# Altium schematic sheet Off-Board Connections.SchDoc
size A
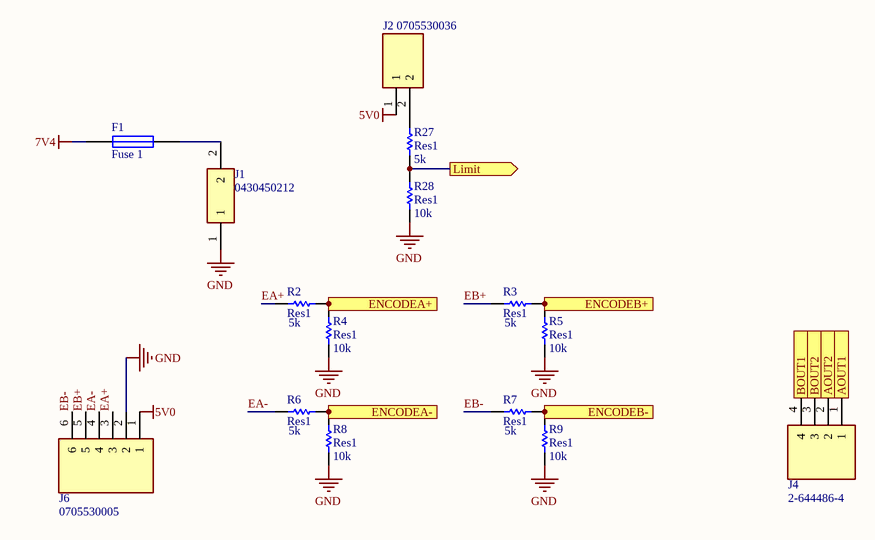
[diagram p0: Off-Board Connections.SchDoc]

## Parts
F1  Fuse 1  [C1206]
J1  0430450212  [0430450212]
J2  0705530036  [SHDRRA2W64P0X254_1X2_737X1359X699P]
J4  2-644486-4  [26444864]
J6  0705530005  [SHDRRA6W64P0X254_1X6_1779X1359X699P]
R2  Res1  value 5k  [0402-A]
R3  Res1  value 5k  [0402-A]
R4  Res1  value 10k  [0402-A]
R5  Res1  value 10k  [0402-A]
R6  Res1  value 5k  [0402-A]
R7  Res1  value 5k  [0402-A]
R8  Res1  value 10k  [0402-A]
R9  Res1  value 10k  [0402-A]
R27  Res1  value 5k  [0402-A]
R28  Res1  value 10k  [0402-A]

## Ports
AOUT1 (in), AOUT2 (in), BOUT1 (in), BOUT2 (in), ENCODEA+ (out), ENCODEA- (out), ENCODEB+ (out), ENCODEB- (out), Limit (out)

## Nets
5V0: J2.1 J6.1
7V4: F1.1
GND: J1.1 J6.2 R4.2 R5.2 R8.2 R9.2 R28.2
AOUT1: J4.1 ; port AOUT1
AOUT2: J4.2 ; port AOUT2
BOUT1: J4.4 ; port BOUT1
BOUT2: J4.3 ; port BOUT2
EA+: J6.3 R2.2
EA-: J6.4 R6.2
EB+: J6.5 R3.2
EB-: J6.6 R7.2
ENCODEA+: R2.1 R4.1 ; port ENCODEA+
ENCODEA-: R6.1 R8.1 ; port ENCODEA-
ENCODEB+: R3.1 R5.1 ; port ENCODEB+
ENCODEB-: R7.1 R9.1 ; port ENCODEB-
Limit: R27.2 R28.1 ; port Limit
NetF1_2: F1.2 J1.2
NetJ2_2: J2.2 R27.1

## Library data of the parts
F1 = Fuse 1: Fuse; Published: 8-Jun-2000; LatestRevisionDate: 17-Jul-2002; LatestRevisionNote: Re-released for DXP Platform.; PackageReference: PIN-W2/E2.8; Publisher: Altium Limited; PackageDescription: Thru-Hole; 2 Leads
J1 = 0430450212: Connector; Manufacturer_Name: Molex; Datasheet Link: http://www.molex.com/pdm_docs/sd/430450212_sd.pdf; Manufacturer_Part_Number: 0430450212; Arrow Part Number: 0430450212; Arrow Price/Stock: https://www.arrow.com/en/products/0430450212/molex
J2 = 0705530036: Connector; Manufacturer_Name: Molex; Datasheet Link: https://www.molex.com/pdm_docs/sd/705530036_sd.pdf; Height: 6.99mm; Manufacturer_Part_Number: 0705530036; Mouser Part Number: N/A; Mouser Price/Stock: https://www.mouser.com/Search/Refine.aspx?Keyword=N%2FA; Arrow Part Number: 0705530036; Arrow Price/Stock: https://www.arrow.com/en/products/0705530036/molex
J4 = 2-644486-4: Connector; Manufacturer_Name: TE Connectivity; Datasheet Link: http://www.te.com/commerce/DocumentDelivery/DDEController?Action=showdoc&DocId=Customer+Drawing%7F644486%7FL%7Fpdf%7FEnglish%7FENG_CD_644486_L_baseFilename.pdf%7F2-644486-4.pdf; Height: 10.668mm; Manufacturer_Part_Number: 2-644486-4; Mouser Part Number: 571-2-644486-4; Mouser Price/Stock: https://www.mouser.co.uk/ProductDetail/TE-Connectivity-AMP/2-644486-4?qs=8XyASyDp%2FcDn2y5ith8QSA%3D%3D; Arrow Part Number: 2-644486-4; Arrow Price/Stock: https://www.arrow.com/en/products/2-644486-4/te-connectivity
J6 = 0705530005: Connector; Manufacturer_Name: Molex; Datasheet Link: https://www.molex.com/pdm_docs/sd/705530005_sd.pdf; Height: 6.99mm; Manufacturer_Part_Number: 0705530005; Mouser Part Number: N/A; Mouser Price/Stock: https://www.mouser.co.uk/ProductDetail/Molex/0705530005?qs=PBcRNPEHKsq8dLeRN2VY7Q%3D%3D; Arrow Part Number: 0705530005; Arrow Price/Stock: https://www.arrow.com/en/products/0705530005/molex
R2-R9 R27 R28 = Res1: Resistor; Published: 8-Jun-2000; LatestRevisionDate: 17-Jul-2002; LatestRevisionNote: Re-released for DXP Platform.; PackageReference: AXIAL-0.3; Publisher: Altium Limited; PackageDescription: Axial Device, Thru-Hole; 2 Leads; 0.3 in Pin Spacing